# Altium schematic sheet Salinity.SchDoc
size A3; SheetNumber: 2; SheetTotal: 3
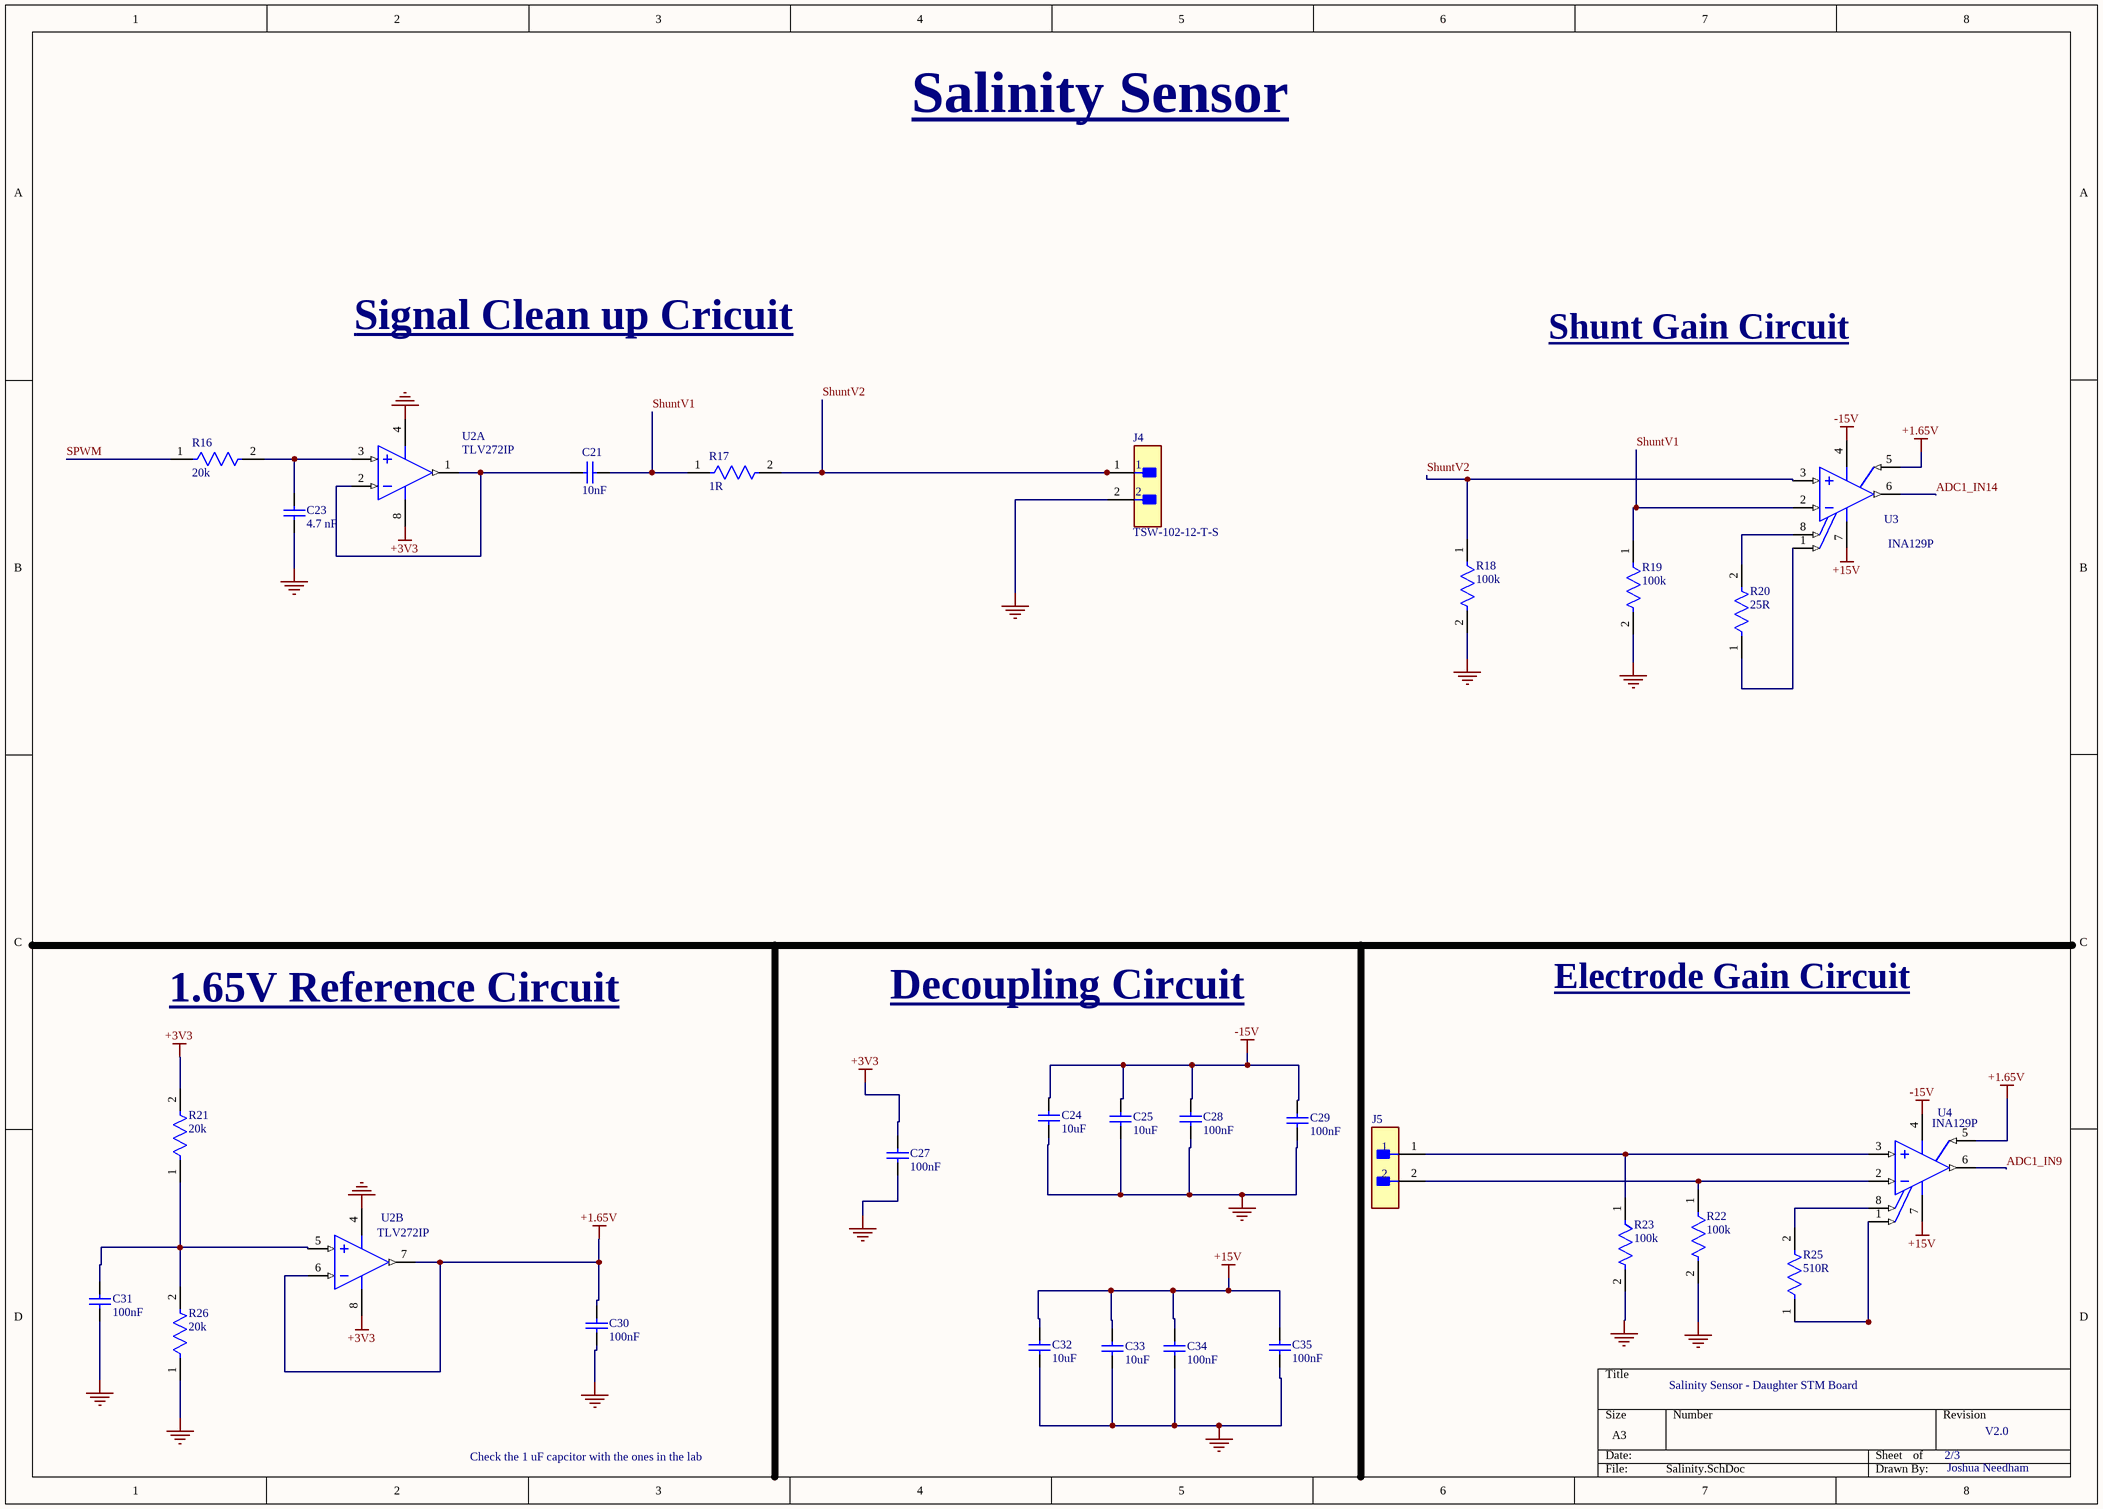
[diagram p0: Salinity.SchDoc]

## Parts
C21  10nF  [CAPC0805(2012)100_M]
C23  4.7 nF  [CAPC0805(2012)100_M]
C24  10uF  [CAPC0805(2012)100_M]
C25  10uF  [CAPC0805(2012)100_M]
C27  100nF  [CAPC0805(2012)100_M]
C28  100nF  [CAPC0805(2012)100_M]
C29  100nF  [CAPC0805(2012)100_M]
C30  100nF  [CAPC0805(2012)100_M]
C31  100nF  [CAPC0805(2012)100_M]
C32  10uF  [CAPC0805(2012)100_M]
C33  10uF  [CAPC0805(2012)100_M]
C34  100nF  [CAPC0805(2012)100_M]
C35  100nF  [CAPC0805(2012)100_M]
J4  TSW-102-12-T-S  [FP-TSW-102-12-T-S-MFG]
J5  TSW-102-12-T-S  [FP-TSW-102-12-T-S-MFG]  (value not drawn)
R16  20k  [FP-CRCW0805-e3-IPC_A]
R17  1R  [FP-CRCW0805-e3-IPC_A]
R18  100k  [FP-CRCW0805-e3-IPC_A]
R19  100k  [FP-CRCW0805-e3-IPC_A]
R20  25R  [FP-CRCW0805-e3-IPC_A]
R21  20k  [FP-CRCW0805-e3-IPC_A]
R22  100k  [FP-CRCW0805-e3-IPC_A]
R23  100k  [FP-CRCW0805-e3-IPC_A]
R25  510R  [FP-CRCW0805-e3-IPC_A]
R26  20k  [FP-CRCW0805-e3-IPC_A]
U2  TLV272IP  [P0008A]  (parts A,B of 2)
U3  INA129P  [P0008A]
U4  INA129P  [P0008A]

## Nets
+1.65V: C30.2 U2.6(IN2-) U2.7(OUT2) U3.5(REF) U4.5(REF)
+3V3: C27.2 R21.2 U2.8(VDD)
+15V: C32.2 C33.2 C34.2 C35.2 U3.7(V+) U4.7(V+)
-15V: C24.2 C25.2 C28.2 C29.2 U3.4(V-) U4.4(V-)
GND: C23.1 C24.1 C25.1 C27.1 C28.1 C29.1 C30.1 C31.1 C32.1 C33.1 C34.1 C35.1 J4.2 R18.2 R19.2 R22.2 R23.2 R26.1 U2.4(GND)
ADC1_IN9: U4.6(VO)
ADC1_IN14: U3.6(VO)
ShuntV1: C21.1 R17.1 R19.1 U3.2(VIN-)
ShuntV2: J4.1 R17.2 R18.1 U3.3(VIN+)
SPWM: R16.1
NetC21_2: C21.2 U2.1(OUT1) U2.2(IN1-)
NetC23_2: C23.2 R16.2 U2.3(IN1+)
NetC31_2: C31.2 R21.1 R26.2 U2.5(IN2+)
NetJ5_1: J5.1 R23.1 U4.3(VIN+)
NetJ5_2: J5.2 R22.1 U4.2(VIN-)
NetR20_1: R20.1 U3.1(RG)
NetR20_2: R20.2 U3.8(RG)
NetR25_1: R25.1 U4.1(RG)
NetR25_2: R25.2 U4.8(RG)

## Notes on the sheet
- Salinity Sensor
- Signal Clean up Cricuit
- Shunt Gain Circuit
- Electrode Gain Circuit
- 1.65V Reference Circuit
- Decoupling Circuit
- Salinity Sensor - Daughter STM Board
- Check the 1 uF capcitor with the ones in the lab
- 2/3
- V2.0
- Joshua Needham

## Library data of the parts
C21 C23-C25 C27-C35 = CMP-1036-04393-1: CAP 100nF 10V ±5% 0805 (2012 Metric) Thickness 1mm SMD; Tolerance: Â±5%; Case-EIA: 0805; Case-Metric: 2012; Rated Voltage: 10 V; Technology: SMT; Value: 100nF; Max Thickness: 1 mm
J4 J5 = CMP-02766-001444-1: CONN HEADER VERT 2POS 2.54MM; Gender: Male; Number of Contacts: 2; RoHS Compliant: Yes; Mount: Through Hole; Termination: Solder; Packaging: Bulk; Contact Material: Bronze; Contact Plating: Tin; Number of Rows: 1; REACH SVHC: No SVHC; Pitch: 2.54mm; Radiation Hardening: No
R16-R23 R25 R26 = CMP-2001-04067-2: RES Thick Film, 680Ω, 5%, 0.125W, 200ppm/°C, 0805; Resistance: 680R; Max Power Dissipation: 125mW; Voltage Rating: 150V; Case Code (Imperial): 0805; Packaging: Tape and Reel; Max Operating Temperature: 155°C; Temperature Coefficient: 200ppm/°C; Case/Package: 0805; Features: Automotive AEC-Q200; Width: 1.25mm; Contact Plating: Tin; Weight: 0.000194oz; Radiation Hardening: No; Case Code (Metric): 2012; Military Standard: Not; Lead Free: Lead Free; Length: 2mm; Depth: 1.25mm; Composition: Thick Film; Power Rating: 125mW; Height: 0.45mm; Min Operating Temperature: -55°C; Number of Terminations: 2; Number of Pins: 2; Tolerance: 5%; Package Quantity: 1; Voltage Rating (DC): 150V; Termination: SMD/SMT
U2 = CMP-0272-02468-3: 550 uA/Ch, 3 MHz, Rail-to-Rail Output Operational Amplifier, 2.7 to 16 V, -40 to 125 degC, 8-pin DIP (P8), Pb-Free (RoHS); Manufacturer: Texas Instruments; Packing: TUBE; Rating: Catalog; IIB(Max)(pA): 60; Slew Rate(Typ)(V/us): 2.1; Sub Family: Low Supply Voltage Amplifier (<=2.7V), Precision Amplifier; GBW(Typ)(MHz): 2.4; Total Supply Voltage(Max)(+5V is 5, +/-5V is 10): 16; Vio (25C)(Max)(mV): 5; CMRR(Min)(dB): 58; Total Supply Voltage(Min)(+5V is 5, +/-5V is 10): 2.7; Offset Drift(Typ)(uV/C): 2; Iq per channel(Max)(mA): 0.56; ComponentLink2URL: http://www.ti.com/lit/ds/symlink/tlv272.pdf; ComponentLink2Description: Datasheet; Code_JEDEC: MS-001; ComponentLink1Description: Manufacturer URL; DatasheetVersion: SLOS351D; PackageDescription: 8-Pin Plastic In-Line, Body 9.59 x 6.35 mm, Pitch 2.54 mm; ComponentLink3Description: Package Specification; Mounting Technology: Through Hole; ComponentLink3URL: http://www.ti.com/litv/pdf/mpdi001b; PackageVersion: 4040082/E, 04/2010; Eco-Plan: Pb-Free (RoHS); ComponentLink1URL: http://www.ti.com/; PartNumber: TLV272IP; PackageReference: P0008A; Number of Channels: 2
U3 U4 = CMP-0992-00137-2: Precision, Low Power Instrumentation Amplifier, -40 to 125 degC, 8-pin DIP (P8), Green (RoHS & no Sb/Br); Manufacturer: Texas Instruments; Input Offset Drift (+/-)(Max)(uV/Degrees Celsius): 0.5; Input Bias Current (+/-)(Max)(nA): 5; Non-Linearity (+/-)(Max)(%): 0.002; Input Offset (+/-)(Max)(uV): 50; Gain(V/V): 1 to 10000; Output Offset Drift (+/-)(Max)(uV/Degrees Celsius): 20/G; Output Offset (+/-)(Max)(uV): 500/G; Number of Channels: 1; Vs(Max)(V): 36; SubFamily: Dual Supply; Vs(Min)(V): 4.5; CMRR(Min)(dB): 120; Quiescent Current (+/-)(Typ)(mA): 0.7; Noise at 1kHz(Typ)(nV/rt(Hz)): 8; ComponentLink3URL: http://www.ti.com/litv/pdf/mpdi001b; PackageVersion: 4040082/E, 04/2010; PartNumber: INA129P; ComponentLink2URL: http://www.ti.com/general/docs/lit/getliterature.tsp?genericPartNumber=INA129&fileType=pdf; ComponentLink3Description: Package Specification; Eco-Plan: Green (RoHS & no Sb/Br); ComponentLink1URL: http://www.ti.com/; ComponentLink1Description: Manufacturer URL; PackageDescription: 8-Pin Plastic In-Line, Body 9.59 x 6.35 mm, Pitch 2.54 mm; DatasheetVersion: SBOS051B; Code_JEDEC: MS-001; Mounting Technology: Through Hole; PackageReference: P0008A; ComponentLink2Description: Datasheet